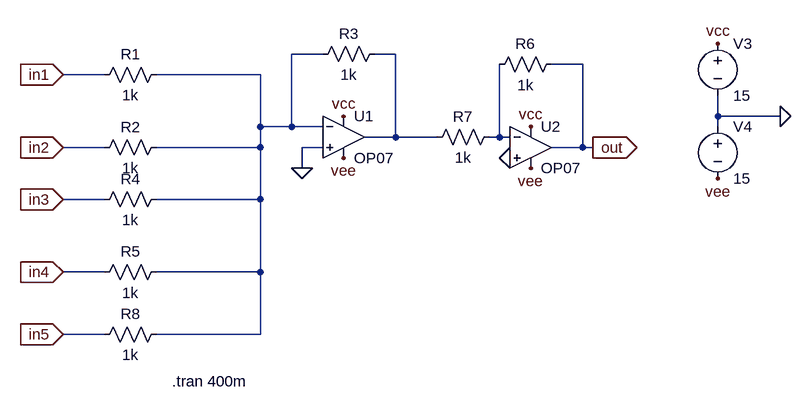
[diagram p0: schematic Adder.asc]
Adder.asc, the LTspice schematic file:
Version 4.1
SHEET 1 1196 680
WIRE 224 32 176 32
WIRE 336 32 304 32
WIRE 624 48 576 48
WIRE -112 64 -176 64
WIRE 128 64 -32 64
WIRE 832 128 832 96
WIRE 928 128 832 128
WIRE 128 144 128 64
WIRE 176 144 176 32
WIRE 176 144 128 144
WIRE 224 144 176 144
WIRE 832 144 832 128
WIRE 336 160 336 32
WIRE 336 160 288 160
WIRE 400 160 336 160
WIRE 496 160 496 48
WIRE 496 160 480 160
WIRE 512 160 496 160
WIRE -112 176 -176 176
WIRE 128 176 128 144
WIRE 128 176 -32 176
WIRE 224 176 192 176
WIRE 624 176 624 48
WIRE 624 176 576 176
WIRE 640 176 624 176
WIRE 192 208 192 176
WIRE -112 256 -176 256
WIRE 128 256 128 176
WIRE 128 256 -32 256
WIRE -112 368 -176 368
WIRE 128 368 128 256
WIRE 128 368 -32 368
WIRE -112 464 -176 464
WIRE 128 464 128 368
WIRE 128 464 -32 464
FLAG 928 128 0
FLAG 832 16 vcc
FLAG 256 128 vcc
FLAG 832 224 vee
FLAG 256 192 vee
FLAG 192 208 0
FLAG -176 64 in1
IOPIN -176 64 In
FLAG -176 176 in2
IOPIN -176 176 In
FLAG -176 256 in3
IOPIN -176 256 In
FLAG -176 368 in4
IOPIN -176 368 In
FLAG 640 176 out
IOPIN 640 176 Out
FLAG 512 192 0
FLAG 544 144 vcc
FLAG 544 208 vee
FLAG -176 464 in5
IOPIN -176 464 In
SYMBOL OpAmps\\OP07 256 96 R0
SYMATTR InstName U1
SYMBOL voltage 832 0 R0
WINDOW 123 0 0 Left 0
WINDOW 39 0 0 Left 0
SYMATTR InstName V3
SYMATTR Value 15
SYMBOL voltage 832 128 R0
WINDOW 123 0 0 Left 0
WINDOW 39 0 0 Left 0
SYMATTR InstName V4
SYMATTR Value 15
SYMBOL res -16 48 R90
WINDOW 0 0 56 VBottom 2
WINDOW 3 32 56 VTop 2
SYMATTR InstName R1
SYMATTR Value 1k
SYMBOL res -16 160 R90
WINDOW 0 0 56 VBottom 2
WINDOW 3 32 56 VTop 2
SYMATTR InstName R2
SYMATTR Value 1k
SYMBOL res -16 240 R90
WINDOW 0 0 56 VBottom 2
WINDOW 3 32 56 VTop 2
SYMATTR InstName R4
SYMATTR Value 1k
SYMBOL res -16 352 R90
WINDOW 0 0 56 VBottom 2
WINDOW 3 32 56 VTop 2
SYMATTR InstName R5
SYMATTR Value 1k
SYMBOL res 320 16 R90
WINDOW 0 0 56 VBottom 2
WINDOW 3 32 56 VTop 2
SYMATTR InstName R3
SYMATTR Value 1k
SYMBOL OpAmps\\OP07 544 112 R0
SYMATTR InstName U2
SYMBOL res 592 32 R90
WINDOW 0 0 56 VBottom 2
WINDOW 3 32 56 VTop 2
SYMATTR InstName R6
SYMATTR Value 1k
SYMBOL res 496 144 R90
WINDOW 0 0 56 VBottom 2
WINDOW 3 32 56 VTop 2
SYMATTR InstName R7
SYMATTR Value 1k
SYMBOL res -16 448 R90
WINDOW 0 0 56 VBottom 2
WINDOW 3 32 56 VTop 2
SYMATTR InstName R8
SYMATTR Value 1k
TEXT -8 536 Left 2 !.tran 400m

The netlist it stands for:
* Adder.asc
X§U1 0 N001 vcc vee N002 LT1001  ; OP07, pins In+ In- V+ V- OUT
V3 vcc 0 15
V4 0 vee 15
R1 N001 in1 1k
R2 N001 in2 1k
R4 N001 in3 1k
R5 N001 in4 1k
R3 N002 N001 1k
X§U2 0 N003 vcc vee out LT1001  ; OP07, pins In+ In- V+ V- OUT
R6 out N003 1k
R7 N003 N002 1k
R8 N001 in5 1k
.tran 400m
.lib LTC.lib
.backanno
.end